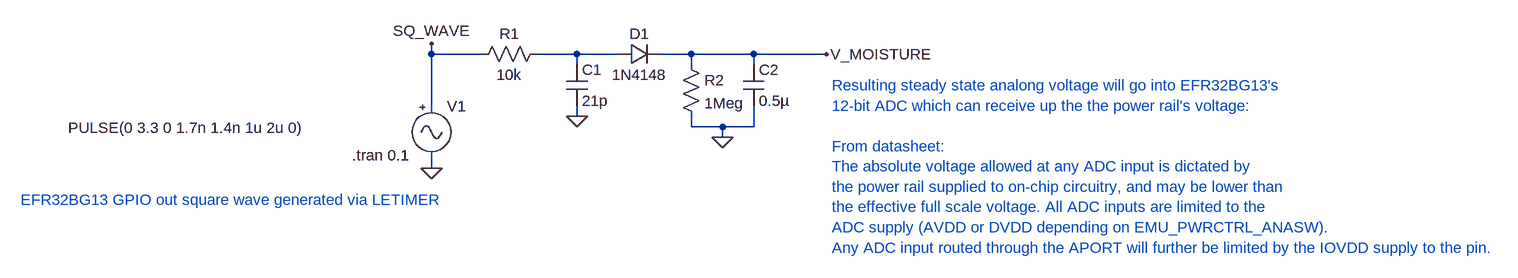
[diagram p0: schematic ms.asc]
ms.asc, the LTspice schematic file:
Version 4
SHEET 1 2216 680
WIRE 112 32 112 16
WIRE 192 32 112 32
WIRE 336 32 272 32
WIRE 400 32 336 32
WIRE 512 32 464 32
WIRE 608 32 512 32
WIRE 720 32 608 32
WIRE 336 48 336 32
WIRE 512 48 512 32
WIRE 608 48 608 32
WIRE 112 112 112 32
WIRE 336 128 336 112
WIRE 512 144 512 128
WIRE 560 144 512 144
WIRE 608 144 608 112
WIRE 608 144 560 144
WIRE 560 160 560 144
WIRE 112 208 112 192
FLAG 112 208 0
FLAG 112 16 SQ_WAVE
FLAG 560 160 0
FLAG 336 128 0
FLAG 720 32 V_MOISTURE
SYMBOL Misc\\signal 112 96 R0
WINDOW 3 -559 49 Left 2
WINDOW 39 0 0 Left 0
SYMATTR InstName V1
SYMATTR Value PULSE(0 3.3 0 1.7n 1.4n 1u 2u 0)
SYMATTR Value2 AC 3.3 0
SYMBOL res 288 16 R90
WINDOW 0 0 56 VBottom 2
WINDOW 3 32 56 VTop 2
SYMATTR InstName R1
SYMATTR Value 10k
SYMBOL cap 320 48 R0
SYMATTR InstName C1
SYMATTR Value 21p
SYMBOL cap 592 48 R0
SYMATTR InstName C2
SYMATTR Value 0.5µ
SYMBOL res 496 32 R0
SYMATTR InstName R2
SYMATTR Value 1Meg
SYMBOL diode 400 48 R270
WINDOW 0 32 32 VTop 2
WINDOW 3 0 32 VBottom 2
SYMATTR InstName D1
SYMATTR Value 1N4148
TEXT -10 188 Left 2 !.tran 0.1
TEXT -520 256 Left 2 ;EFR32BG13 GPIO out square wave generated via LETIMER
TEXT 728 80 Left 2 ;Resulting steady state analong voltage will go into EFR32BG13's\n12-bit ADC which can receive up the the power rail's voltage:\n \nFrom datasheet:\nThe absolute voltage allowed at any ADC input is dictated by \nthe power rail supplied to on-chip circuitry, and may be lower than\nthe effective full scale voltage. All ADC inputs are limited to the \nADC supply (AVDD or DVDD depending on EMU_PWRCTRL_ANASW). \nAny ADC input routed through the APORT will further be limited by the IOVDD supply to the pin.

The netlist it stands for:
* ms.asc
V1 SQ_WAVE 0 PULSE(0 3.3 0 1.7n 1.4n 1u 2u 0) AC 3.3 0
R1 N001 SQ_WAVE 10k
C1 N001 0 21p
C2 V_MOISTURE 0 0.5µ
R2 V_MOISTURE 0 1Meg
D1 N001 V_MOISTURE 1N4148
.model D D
.lib standard.dio
.tran 0.1
* EFR32BG13 GPIO out square wave generated via LETIMER
* Resulting steady state analong voltage will go into EFR32BG13's
* 12-bit ADC which can receive up the the power rail's voltage:
* From datasheet:
* The absolute voltage allowed at any ADC input is dictated by
* the power rail supplied to on-chip circuitry, and may be lower than
* the effective full scale voltage. All ADC inputs are limited to the
* ADC supply (AVDD or DVDD depending on EMU_PWRCTRL_ANASW).
* Any ADC input routed through the APORT will further be limited by the IOVDD supply to the pin.
.backanno
.end